# EAGLE schematic BMSNode (EAGLE 7.6.0)
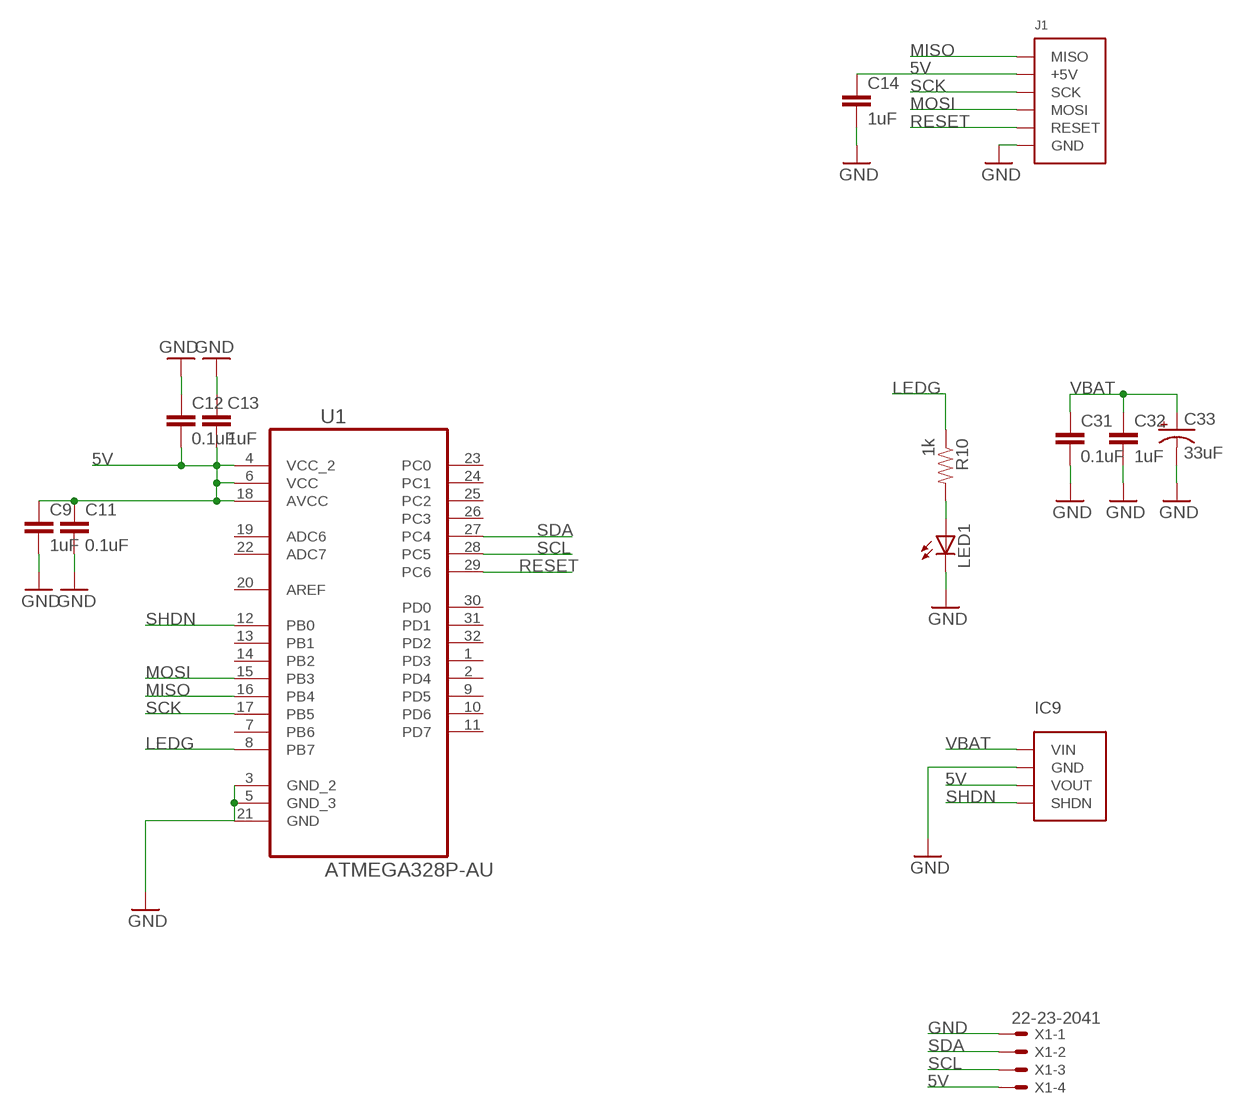
[diagram p0: schematic, sheet 1]

## Parts
C9  1uF  0.33UF-50V-10%(0805)  [0805-CAP]
C11  0.1uF  0.33UF-50V-10%(0805)  [0805-CAP]
C12  0.1uF  0.33UF-50V-10%(0805)  [0805-CAP]
C13  1uF  0.33UF-50V-10%(0805)  [0805-CAP]
C14  1uF  0.33UF-50V-10%(0805)  [0805-CAP]
C31  0.1uF  0.33UF-50V-10%(0805)  [0805-CAP]
C32  1uF  0.33UF-50V-10%(0805)  [0805-CAP]
C33  33uF  CAP_POLF80  [NIPPON_F80]
IC9  5VBUCK_DANNY_CUSTOM_PCB  [4PIN_.1']
J1  ISPHEADER  [2X3PIN_.1']
LED1  LEDCHIPLED_0805  [CHIPLED_0805]
R10  1k  0.3OHM-1/8W-1%(0805)  [0805]
U1  ATMEGA328P-AU  [QFP80P900X900X120-32N]
X1  22-23-2041  [22-23-2041]

## Nets
5V: C9.1 C11.1 C12.2 C13.2 C14.1 IC9.P$3(VOUT) J1.P$2(+5V) U1.4(VCC_2) U1.6(VCC) U1.18(AVCC) X1.4
GND: C9.2 C11.2 C12.1 C13.1 C14.2 C31.2 C32.2 C33.- IC9.P$2(GND) J1.P$6(GND) LED1.C U1.3(GND_2) U1.5(GND_3) X1.1
LEDG: R10.1 U1.8(PB7)
MISO: J1.P$1(MISO) U1.16(PB4)
MOSI: J1.P$4(MOSI) U1.15(PB3)
N$19: LED1.A R10.2
RESET: J1.P$5(RESET)
SCK: J1.P$3(SCK) U1.17(PB5)
SCL: U1.28(PC5) X1.3
SDA: U1.27(PC4) X1.2
SHDN: IC9.P$4(SHDN) U1.12(PB0)
VBAT: C31.1 C32.1 C33.+ IC9.P$1(VIN)
Unconnected: U1.1(PD3) U1.2(PD4) U1.7(PB6) U1.9(PD5) U1.10(PD6) U1.11(PD7) U1.13(PB1) U1.14(PB2) U1.19(ADC6) U1.20(AREF) U1.21(GND) U1.22(ADC7) U1.23(PC0) U1.24(PC1) U1.25(PC2) U1.26(PC3) U1.29(PC6) U1.30(PD0) U1.31(PD1) U1.32(PD2)

## Library data of the parts
C9 C11-C14 C31 C32 = SparkFun-Capacitors:0.33UF-50V-10%(0805): CAP-08469; PROD_ID: CAP-08469; VALUE: 0.33uF
C33 = SparkFun-Capacitors:CAP_POL: Capacitor Polarized These are standard SMD and PTH capacitors. Normally 10uF, 47uF, and 100uF in electrolytic and tantalum varieties. Always verify the external diameter of the through hole cap, it varies with capacity, voltage, and manufacturer. The EIA devices should be standard.
IC9 = lolomolo:5VBUCK_DANNY_CUSTOM_PCB
J1 = lolomolo:ISPHEADER
LED1 = adafruit:LED: LED OSRAM: - CHIPLED LG R971, LG N971, LY N971, LG Q971, LY Q971, LO R971, LY R971 LH N974, LH R974 LS Q976, LO Q976, LY Q976 LO Q996 - Hyper CHIPLED LW Q18S LB Q993, LB Q99A, LB R99A - SideLED LS A670, LO A670, LY A670, LG A670, LP A670 LB A673, LV A673, LT A673, LW A673 LH A674 LY A675 LS A676, LA A676, LO A676, LY A676, LW A676 LS A679, LY A679, LG A679 - Hyper Micro SIDELED® LS Y876, LA Y876, LO Y876, LY Y876 LT Y87S - SmartLED LW L88C, LW L88S LB L89C, LB L89S, LG L890 LS L89K, LO L89K, LY L89K LS L896, LA L896, LO L896, LY L896 - TOPLED LS T670, LO T670, LY T670, LG T670, LP T670 LSG T670, LSP T670, LSY T670, LOP T670, LYG T670 LG T671, LOG T671, LSG T671 LB T673, LV T673, LT T673, LW T673 LH T674 LS T676, LA T676, LO T676, LY T676, LB T676, LH T676, LSB T676, LW T676 LB T67C, LV T67C, LT T67C, LS T67K, LO T67K, LY T67K, LW E67C LS E67B, LA E67B, LO E67B, LY E67B, LB E67C, LV E67C, LT E67C LW T67C LS T679, LY T679, LG T679 LS T770, LO T770, LY T770, LG T770, LP T770 LB T773, LV T773, LT T773, LW T773 LH T774 LS E675, LA E675, LY E675, LS T675 LS T776, LA T776, LO T776, LY T776, LB T776 LHGB T686 LT T68C, LB T68C - Hyper Mini TOPLED® LB M676 - Mini TOPLED Santana® LG M470 LS M47K, LO M47K, LY M47K Source: http://www.osram.convergy.de/
R10 = SparkFun-Resistors:0.3OHM-1/8W-1%(0805): RES-11622; PROD_ID: RES-11622; VALUE: 0.3
U1 = Atmel_By_element14_Batch_1-00:ATMEGA328P-AU: 8-bit Microcontroller with In-System Programmable Flash; MPN: ATMEGA328P-AU; OC_FARNELL: 1715486; OC_NEWARK: 14R4631; PACKAGE: TQFP-32; SUPPLIER: Atmel
X1 = con-molex:22-23-2041: .100" (2.54mm) Center Header - 4 Pin; MF: MOLEX; MPN: 22-23-2041; OC_FARNELL: 1462920; OC_NEWARK: 38C0355